# Altium schematic sheet tekprobe.SchDoc: TEKPROBE power supply
size 138 x 199 mm; Date: 2 MAY 2021; DocumentNumber: 7.13.27.001.0521; Revision: R1 / 2 MAY 2021; SheetNumber: 1; SheetTotal: 2; _Page_Title: DC DC Converter; ProjectName: Stromnetz
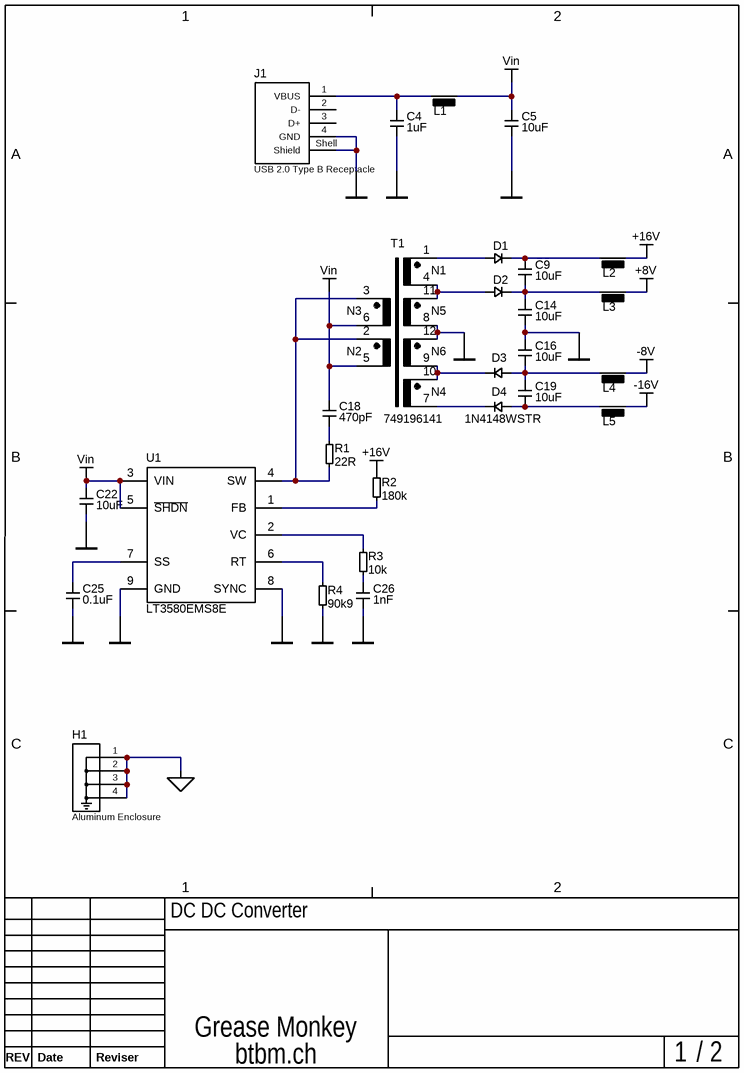
[diagram p0: tekprobe.SchDoc]

## Parts
C4  1uF  [CAP_0805]
C5  10uF  [CAP_0805]
C9  10uF  [CAP_0805]
C14  10uF  [CAP_0805]
C16  10uF  [CAP_0805]
C18  470pF  [CAP_0805]
C19  10uF  [CAP_0805]
C22  10uF  [CAP_0805]
C25  0.1uF  [CAP_0805]
C26  1nF  [CAP_0805]
D1  1N4148WSTR  [SODFL250X100-2N]  (value not drawn)
D2  1N4148WSTR  [SODFL250X100-2N]  (value not drawn)
D3  1N4148WSTR  [SODFL250X100-2N]  (value not drawn)
D4  1N4148WSTR  [SODFL250X100-2N]
H1  Aluminum Enclosure  [1550Q]
J1  USB 2.0 Type B Receptacle  [61400413321]
L1  Ferrite Bead  [RES_0805]  (value not drawn)
L2  Ferrite Bead  [RES_0805]  (value not drawn)
L3  Ferrite Bead  [RES_0805]  (value not drawn)
L4  Ferrite Bead  [RES_0805]  (value not drawn)
L5  Ferrite Bead  [RES_0805]  (value not drawn)
R1  22R  [RES_0805]
R2  180k  [RES_0805]
R3  10k  [RES_0805]
R4  90k9  [RES_0805]
T1  Manufacturer Part Number: 749196141  [WE-FLEX_ER11/5]  (hidden comment: Transformer)
U1  LT3580EMS8E  [LT3580]

## Nets
0V: C4.2 C5.2 C14.2 C16.1 C22.2 C25.2 C26.2 H1.1(DATA) H1.2(-15V) H1.3(-5V) H1.4(OFFSET) J1.4(GND) J1.Shell(Shield) R4.2 T1.8(N5) T1.12(N6dot) U1.8(SYNC) U1.9(GND)
+8V: L3.2
+16V: L2.2 R2.1
-8V: L4.2
-16V: L5.2
Vin: C5.1 C18.1 C22.1 L1.2 T1.5(N2) T1.6(N3) U1.3(VIN) U1.5(~{SHDN})
NetC4_1: C4.1 J1.1(VBUS) L1.1
NetC9_1: C9.1 D1.K L2.1
NetC9_2: C9.2 C14.1 D2.K L3.1
NetC16_2: C16.2 C19.1 D3.A L4.1
NetC18_2: C18.2 R1.1
NetC19_2: C19.2 D4.A L5.1
NetC25_1: C25.1 U1.7(SS)
NetC26_1: C26.1 R3.2
NetD1_A: D1.A T1.1(N1dot)
NetD2_A: D2.A T1.4(N1) T1.11(N5dot)
NetD3_K: D3.K T1.9(N6) T1.10(N4dot)
NetD4_K: D4.K T1.7(N4)
NetR1_2: R1.2 T1.2(N2dot) T1.3(N3dot) U1.4(SW)
NetR2_2: R2.2 U1.1(FB)
NetR3_1: R3.1 U1.2(VC)
NetR4_1: R4.1 U1.6(RT)

Not connected (* = marked no-connect by the designer): J1 2(D-) 3(D+)

## Notes on the sheet
- 1
- 2
- A
- B
- C
- REV
- Date
- Reviser
- Grease Monkey
- btbm.ch
- /

## Library data of the parts
C4 = CL21B105KAFNFNE: CAP CER 1UF 25V X7R 0805; Manufacturer: Samsung; Tolerance: 10%; Supplier 1: Digi-Key; Manufacturer Part Number: CL21B105KAFNFNE; RoHS: Yes; Category: Ceramic Capacitors; Stock 1: 271579; Pricing 1: 1=0.10000, 10=0.07300, 50=0.03980, 100=0.03260, 500=0.02326, 1000=0.01828 (USD); Mount: Surface Mount; Case/Package: 0805; Case Code (Metric): 2012; Case Code (Imperial): 0805; Min Operating Temperature: -55°C; Max Operating Temperature: 125°C; Capacitance: 1uF; Voltage Rating: 25V; Package Quantity: 1; Packaging: Tape and Reel; Dielectric: X7R; Series: CL; Construction: Flat; Length: 0.079inch; Width: 0.049inch; Height: 1.25mm; Thickness: 0.053inch; Depth: 1.25mm; Radiation Hardening: No; RoHS Compliant: Yes; ComponentLink1URL: https://datasheet.ciiva.com/25713/cl21b105kafnfne-25713092.pdf?src-supplier=Digi-Key; ComponentLink1Description: https://datasheet.ciiva.com/25713/cl21b105kafnfne-25713092.pdf?src-supplier=Digi-Key; Supplier Part Number 1: 1276-2926-1-ND
C5 C9 C14 C16 C19 C22 = CL21A106KAYNNNG: CAP CER 10UF 25V X5R 0805; Manufacturer: Samsung; Tolerance: 10%; Supplier 1: Digi-Key; Manufacturer Part Number: CL21A106KAYNNNG; RoHS: Yes; Category: Ceramic Capacitors; Stock 1: 221798; Pricing 1: 1=0.21000, 10=0.14600, 50=0.08280, 100=0.06870, 500=0.04816, 1000=0.03987 (USD); Mount: Surface Mount; Case/Package: 0805; Case Code (Metric): 2012; Case Code (Imperial): 0805; Min Operating Temperature: -55°C; Max Operating Temperature: 85°C; Capacitance: 10uF; Dielectric: X5R; Packaging: Tape and Reel; Package Quantity: 3000; Voltage Rating: 25V; Series: CL; Construction: Flat; Length: 2mm; Width: 0.049inch; Height: 1.25mm; Thickness: 0.057inch; Depth: 1.25mm; Radiation Hardening: No; Lead Free: Lead Free; RoHS Compliant: Yes; ComponentLink1URL: https://datasheet.ciiva.com/26920/getdatasheetpartid-660292-26920195.pdf?src-supplier=Verical; ComponentLink1Description: https://datasheet.ciiva.com/26920/getdatasheetpartid-660292-26920195.pdf?src-supplier=Verical; Supplier Part Number 1: 1276-6454-1-ND
C18 = 885012207084: CAP CER 470PF 50V X7R 0805; Manufacturer: Wurth Electronics; Tolerance: 10%; Supplier 1: Digi-Key; Manufacturer Part Number: 885012207084; RoHS: Yes; Category: Ceramic Capacitors; Stock 1: 227; Pricing 1: 1=0.10000, 10=0.04000, 100=0.03590, 500=0.03172 (USD); Mount: Surface Mount; Case/Package: 0805; Case Code (Metric): 2012; Case Code (Imperial): 0805; Min Operating Temperature: -55°C; Max Operating Temperature: 125°C; Packaging: Tape and Reel; Capacitance: 470pF; Voltage Rating: 50V; Length: 0.079inch; Width: 0.049inch; Thickness: 0.035inch; RoHS Compliant: Yes; ComponentLink1URL: https://katalog.we-online.de/pbs/datasheet/885012207084.pdf?src-supplier=Digi-Key; ComponentLink1Description: https://katalog.we-online.de/pbs/datasheet/885012207084.pdf?src-supplier=Digi-Key; Supplier Part Number 1: 732-8066-1-ND
C25 = CL21B104MACNNNC: CAP CER 0.1UF 25V X7R 0805; Manufacturer: Samsung; Tolerance: 20%; Capacitance: 100nF; Supplier 1: Digi-Key; Manufacturer Part Number: CL21B104MACNNNC; RoHS: Yes; Category: Ceramic Capacitors; Stock 1: 134913; Pricing 1: 1=0.10000, 10=0.03200, 50=0.01720, 100=0.01410, 500=0.01006, 1000=0.00791 (USD); Mount: Surface Mount; Case/Package: 0805; Case Code (Metric): 2012; Case Code (Imperial): 0805; Min Operating Temperature: -55°C; Max Operating Temperature: 125°C; Dielectric: X7R; Packaging: Tape and Reel; Package Quantity: 1; Voltage Rating: 25V; Voltage Rating (DC): 25V; Series: CL; Construction: Flat; Length: 2mm; Width: 0.049inch; Height: 0.85mm; Depth: 1.25mm; Thickness: 0.037inch; Radiation Hardening: No; Lead Free: Lead Free; RoHS Compliant: Yes; ComponentLink1URL: https://datasheet.ciiva.com/26936/getdatasheetpartid-782453-26936905.pdf?src-supplier=Verical; ComponentLink1Description: https://datasheet.ciiva.com/26936/getdatasheetpartid-782453-26936905.pdf?src-supplier=Verical; Supplier Part Number 1: 1276-2449-1-ND
C26 = CL21B102KBANNNC: Cap Ceramic 0.001uF 50VDC X7R 10% SMD 0805 Paper T/R; Manufacturer: Samsung; Voltage Rating: 50V; Supplier 1: Digi-Key; Manufacturer Part Number: CL21B102KBANNNC; RoHS: Yes; Category: Ceramic Capacitors; Stock 1: 281332; Pricing 1: 1=0.10000, 10=0.04300, 50=0.02340, 100=0.01920, 500=0.01368, 1000=0.01075 (USD); Mount: Surface Mount; Case/Package: 0805; Case Code (Metric): 2012; Case Code (Imperial): 0805; Material: Ceramic; Contact Plating: Tin; Min Operating Temperature: -55°C; Max Operating Temperature: 125°C; Tolerance: 10%; Capacitance: 1nF; Dielectric: X7R; Packaging: Tape and Reel; Package Quantity: 4000; Voltage: 50V; Series: CL; Construction: Flat; Length: 2mm; Width: 0.049inch; Height: 0.65mm; Depth: 1.25mm; Thickness: 0.03inch; Radiation Hardening: No; RoHS Compliant: Yes; ComponentLink1URL: https://datasheet.ciiva.com/25802/cl21b102kbannnc-25802496.pdf?src-supplier=Digi-Key; ComponentLink1Description: https://datasheet.ciiva.com/25802/cl21b102kbannnc-25802496.pdf?src-supplier=Digi-Key; ComponentLink2URL: https://datasheet.ciiva.com/26838/getdatasheetpartid-357425-26838638.pdf?src-supplier=Verical; ComponentLink2Description: https://datasheet.ciiva.com/26838/getdatasheetpartid-357425-26838638.pdf?src-supplier=Verical; ComponentLink3URL: https://datasheet.ciiva.com/29199/456076-da-01-en-vs-kondensator-0805-29199069.pdf?src-supplier=Conrad; ComponentLink3Description: https://datasheet.ciiva.com/29199/456076-da-01-en-vs-kondensator-0805-29199069.pdf?src-supplier=Conrad; Supplier Part Number 1: 1276-1020-1-ND
D1-D4 = 1N4148WSTR: DIODE GEN PURP 75V 300MA SOD323; Manufacturer: SMC; Reverse Recovery Time: 4ns; Supplier 1: Digi-Key; Manufacturer Part Number: 1N4148WSTR; RoHS: No; Category: Rectifier Diodes; Stock 1: 173635; Pricing 1: 1=0.13000, 10=0.12100, 100=0.06610, 500=0.04066, 1000=0.02772 (USD); Mount: Surface Mount; Packaging: Tape and Reel; Max Reverse Voltage (DC): 75V; Average Rectified Current: 300mA; ComponentLink1URL: http://www.smc-diodes.com/propdf/1N4148WS%20N0572%20REV.B.pdf?src-supplier=Digi-Key; ComponentLink1Description: http://www.smc-diodes.com/propdf/1N4148WS%20N0572%20REV.B.pdf?src-supplier=Digi-Key; Supplier Part Number 1: 1655-1359-1-ND
H1 = 1550Q: BOX ALUM UNPAINTED 2.36"LX2.17"W; Manufacturer: Hammond Manufacturing; Body Material: Aluminium; Ratings: IP54; Supplier 1: Digi-Key; Manufacturer Part Number: 1550Q; RoHS: Yes; Category: Enclosures; Stock 1: 666; Pricing 1: 1=6.46000, 5=5.97600, 10=5.49100, 25=5.16800, 50=4.84500, 100=4.52200, 250=4.44124, 500=4.36050, 1000=4.29590 (USD); Case/Package: Metal; Material: Aluminium,Metal; Weight: 6.702053oz; Housing Material: Aluminium; Color: Natural; Package Quantity: 1; Length: 2.362inch; Width: 2.17inch; Height: 1.185inch; Thickness: 0.059inch; Depth: 26mm; REACH SVHC: No SVHC; ComponentLink1URL: https://datasheet.ciiva.com/20198/30-3787-20198174.pdf?src-supplier=Rapid+Electronics; ComponentLink1Description: https://datasheet.ciiva.com/20198/30-3787-20198174.pdf?src-supplier=Rapid+Electronics; ComponentLink2URL: https://datasheet.ciiva.com/29344/534473-da-01-en-aluminiumgeh-1550q-60x55x30mm-29344749.pdf?src-supplier=Conrad; ComponentLink2Description: https://datasheet.ciiva.com/29344/534473-da-01-en-aluminiumgeh-1550q-60x55x30mm-29344749.pdf?src-supplier=Conrad; ComponentLink3URL: https://datasheet.ciiva.com/16928/70165840-16928747.pdf?src-supplier=Allied+Electronics; ComponentLink3Description: https://datasheet.ciiva.com/16928/70165840-16928747.pdf?src-supplier=Allied+Electronics; Supplier Part Number 1: HM1204-ND
J1 = 61400413321: USB 2.0 Type B, Receptacle, Vertical, THT; Manufacturer: Wurth Elektronik; Rated Current: 1.5A; Pin Number: 4; Interface Type: Type B; Working Voltage: 30VAC; ComponentLink1Description: Manufacturer; ComponentLink1URL: http://www.we-online.de; ComponentLink2Description: Datasheet; ComponentLink2URL: https://katalog.we-online.com/em/datasheet/61400413321.pdf; Published Date: August 2020; Manufacturer Part Number: 61400413321; Gender: Receptacle; Type: Vertical; Packaging: Tray; Operating Temperature: -40 to +105degC; Mounting Technology: THT; Application: USB 2.0
L1-L5 = MFBW1V2012-801-R: Ferrite Chip Bead 800Ohm 800mA 0.3Ohm Multi-Layer 2-Pin 0805 T/R; Manufacturer: Cooper Bussmann; Supplier 1: Digi-Key; Manufacturer Part Number: MFBW1V2012-801-R; Stock 1: 1000; Pricing 1: 1=0.10000, 10=0.04800, 25=0.04280, 50=0.03820, 100=0.03250, 250=0.02868, 500=0.02628, 1000=0.02245 (USD); ComponentLink1URL: http://datasheet.octopart.com/MFBW1V2012-801-R-Cooper-Bussmann-datasheet-147669139.pdf?src-supplier=Sager+Electronics; ComponentLink1Description: http://datasheet.octopart.com/MFBW1V2012-801-R-Cooper-Bussmann-datasheet-147669139.pdf?src-supplier=Sager+Electronics; Supplier Part Number 1: 283-MFBW1V2012-801-RCT-ND
R1 = RMCF0805FT22R0: RES 22 OHM 1/8W 1% 0805 SMD; Manufacturer: Stackpole Electronics; Power Rating: 125mW; Temperature Coefficient: 100ppm/°C; Supplier 1: Digi-Key; Manufacturer Part Number: RMCF0805FT22R0; RoHS: Yes; Category: Chip SMD Resistors; Stock 1: 126411; Pricing 1: 1=0.10000, 10=0.02700, 100=0.01090, 1000=0.00488, 2500=0.00423 (USD); Mount: Surface Mount; Case/Package: 0805; Case Code (Metric): 2012; Case Code (Imperial): 0805; Contact Plating: Tin,Matte; Size Code: 0805; Min Operating Temperature: -55°C; Max Operating Temperature: 155°C; Resistance: 22R; Tolerance: 1%; Packaging: Tape and Reel; Resistor Type: Thick Film; Number of Terminations: 2; Max Power Dissipation: 125mW; Features: Automotive AEC-Q200; Series: RMCF; Length: 0.079inch; Width: 0.049inch; Height: 0.026inch; Radiation Hardening: No; Lead Free: Lead Free; RoHS Compliant: Yes; ComponentLink1URL: http://components.arrow.com/part/dataview/53343875S4424N1174?src-supplier=Arrow+Electronics; ComponentLink1Description: http://components.arrow.com/part/dataview/53343875S4424N1174?src-supplier=Arrow+Electronics; ComponentLink2URL: https://www.seielect.com/catalog/SEI-Packaging.pdf?src-supplier=Digi-Key; ComponentLink2Description: https://www.seielect.com/catalog/SEI-Packaging.pdf?src-supplier=Digi-Key; ComponentLink3URL: http://www.seielect.com/Catalog/SEI-RMC.pdf?src-supplier=Future+Electronics; ComponentLink3Description: http://www.seielect.com/Catalog/SEI-RMC.pdf?src-supplier=Future+Electronics; ComponentLink4URL: https://www.seielect.com/catalog/SEI-RMCF_RMCP.pdf?src-supplier=Avnet; ComponentLink4Description: https://www.seielect.com/catalog/SEI-RMCF_RMCP.pdf?src-supplier=Avnet; Supplier Part Number 1: RMCF0805FT22R0CT-ND
R2 = RK73H2ATTD1803F: Thick Film Resistors 1/4W 180K OHM 1%; Manufacturer: KOA Speer; Resistance: 180kR; Power Rating: 125mW; Voltage Rating: 150V; Temperature Coefficient: 100ppm/°C; Supplier 1: Digi-Key; Manufacturer Part Number: RK73H2ATTD1803F; RoHS: Yes; Category: Chip SMD Resistors; Stock 1: 4592; Pricing 1: 1=0.10000, 10=0.03500, 100=0.01420, 1000=0.00640, 2500=0.00556 (USD); Case/Package: 0805; Number of Pins: 2; Case Code (Imperial): 0805; Case Code (Metric): 2012; Min Operating Temperature: -55°C; Max Operating Temperature: 155°C; Tolerance: 1%; Packaging: Tape and Reel; Resistor Type: Thick Film; Termination: SMD/SMT; Series: RK73H; Construction: Rectangular; Resistance Tolerance: 1%; Length: 2mm; Depth: 1.25mm; Military Standard: Not; Lead Free: Lead Free; RoHS Compliant: Yes; ComponentLink1URL: https://datasheet.ciiva.com/5557/rk73h-5557292.pdf?src-supplier=Mouser; ComponentLink1Description: https://datasheet.ciiva.com/5557/rk73h-5557292.pdf?src-supplier=Mouser; ComponentLink2URL: https://datasheet.ciiva.com/7763/549017-7763166.pdf?src-supplier=Element14; ComponentLink2Description: https://datasheet.ciiva.com/7763/549017-7763166.pdf?src-supplier=Element14; Supplier Part Number 1: 2019-RK73H2ATTD1803FCT-ND
R3 = RMCF0805FT10K0: RES 10K OHM 1% 1/8W 0805; Manufacturer: Stackpole Electronics; Resistance: 10kR; Power Rating: 125mW; Temperature Coefficient: 100ppm/°C; Supplier 1: Digi-Key; Manufacturer Part Number: RMCF0805FT10K0; RoHS: Yes; Category: Chip SMD Resistors; Stock 1: 1832609; Pricing 1: 1=0.10000, 10=0.02700, 100=0.01090, 1000=0.00488, 2500=0.00423 (USD); Mount: Surface Mount; Case/Package: 0805; Case Code (Metric): 2012; Case Code (Imperial): 0805; Contact Plating: Tin,Matte; Size Code: 0805; Min Operating Temperature: -55°C; Max Operating Temperature: 155°C; Tolerance: 1%; Packaging: Tape and Reel; Resistor Type: Thick Film; Number of Terminations: 2; Max Power Dissipation: 125mW; Features: Automotive AEC-Q200; Series: RMCF; Construction: Rectangular; Length: 2mm; Width: 0.049inch; Height: 0.026inch; Depth: 1.25mm; Radiation Hardening: No; Lead Free: Lead Free; Military Standard: Not; RoHS Compliant: Yes; ComponentLink1URL: https://datasheet.ciiva.com/15193/getdatasheetpartid-362046-15193525.pdf?src-supplier=Verical; ComponentLink1Description: https://datasheet.ciiva.com/15193/getdatasheetpartid-362046-15193525.pdf?src-supplier=Verical; Supplier Part Number 1: RMCF0805FT10K0CT-ND
R4 = RMCF0805FT90K9: Res Thick Film 0805 90.9K Ohm 1% 0.125W ±100ppm/°C Molded SMD Paper T/R; Manufacturer: Stackpole Electronics; Resistance: 90.9kR; Power Rating: 125mW; Supplier 1: Digi-Key; Manufacturer Part Number: RMCF0805FT90K9; RoHS: Yes; Category: Chip SMD Resistors; Stock 1: 27691; Pricing 1: 1=0.10000, 10=0.02700, 100=0.01090, 1000=0.00488, 2500=0.00423 (USD); Mount: Surface Mount; Case/Package: 0805; Case Code (Metric): 2012; Case Code (Imperial): 0805; Contact Plating: Tin,Matte; Size Code: 0805; Min Operating Temperature: -55°C; Max Operating Temperature: 155°C; Tolerance: 1%; Packaging: Tape and Reel; Resistor Type: Thick Film; Number of Terminations: 2; Max Power Dissipation: 125mW; Temperature Coefficient: 100ppm/°C; Features: Automotive AEC-Q200; Series: RMCF; Construction: Rectangular; Length: 0.079inch; Width: 0.049inch; Height: 0.026inch; Depth: 1.25mm; Radiation Hardening: No; Military Standard: Not; Lead Free: Lead Free; RoHS Compliant: Yes; ComponentLink1URL: https://datasheet.ciiva.com/3882/40960751s7172021n1174-3882844.pdf?src-supplier=Arrow+Electronics; ComponentLink1Description: https://datasheet.ciiva.com/3882/40960751s7172021n1174-3882844.pdf?src-supplier=Arrow+Electronics; ComponentLink2URL: https://datasheet.ciiva.com/15193/getdatasheetpartid-464223-15193623.pdf?src-supplier=Verical; ComponentLink2Description: https://datasheet.ciiva.com/15193/getdatasheetpartid-464223-15193623.pdf?src-supplier=Verical; Supplier Part Number 1: RMCF0805FT90K9CT-ND
T1 = Transformer_749196141: Flex Transformer WE-FLEX ER11/5; Manufacturer: Wurth Electronics; Secondary Current: 550mA; Inductance: 8.5uH; Turns Ratio: 1:1; Isolation Voltage: 500V; DC Resistance (DCR): 344mR; Max Frequency: 1MHz; Supplier 1: Digi-Key; RoHS: Yes; Category: Uncategorized; Stock 1: 1871; Pricing 1: 1=5.06000, 10=4.59200, 50=4.15500, 100=3.69600 (USD); Mount: Surface Mount; Min Operating Temperature: -40°C; Max Operating Temperature: 125°C; Packaging: Cut Tape; Series: WE-FLEX; Length: 12.9mm; Width: 9.2mm; Depth: 6.2mm; RoHS Compliant: Yes; ComponentLink1URL: https://datasheet.ciiva.com/16989/0900766b80649932-16989928.pdf?src-supplier=Allied+Electronics; ComponentLink1Description: https://datasheet.ciiva.com/16989/0900766b80649932-16989928.pdf?src-supplier=Allied+Electronics
U1 = LT3580EMS8E: IC REG MULT CONFIG INV ADJ 8MSOP; Manufacturer: Analog Devices / Linear Technology; Manufacturer Part Number: LT3580EMS8E#PBF; Max Input Voltage: 32V; Max Output Current: 2.8A; Min Input Voltage: 2.5V; Output Current: 2A; Output Voltage: 12V; Efficiency: 88%; Number of Outputs: 1; Switching Frequency: 2.5MHz; Synchronous Rectifier: No; Max Output Voltage: 42V; Min Output Voltage: -400mV; Topology: Boost; Output Type: Fixed,Adjustable; Supplier 1: Digi-Key; RoHS: Yes; Category: Voltage Regulators - Switching; Stock 1: 2999; Pricing 1: 1=5.62000, 10=5.04600, 25=4.77000, 100=4.13400, 250=3.92200, 500=3.51920, 1000=3.00000 (USD); Case/Package: MSOP; Number of Pins: 8; Min Operating Temperature: -40°C; Max Operating Temperature: 125°C; Package Quantity: 50; Packaging: Rail/Tube; Length: 3mm; Width: 3mm; Height: 0.86mm; REACH SVHC: No SVHC; ComponentLink1URL: https://datasheet.ciiva.com/7363/85270-7363576.pdf?src-supplier=Newark; ComponentLink1Description: https://datasheet.ciiva.com/7363/85270-7363576.pdf?src-supplier=Newark; ComponentLink2URL: https://datasheet.ciiva.com/6192/1599224-6192934.pdf?src-supplier=Farnell; ComponentLink2Description: https://datasheet.ciiva.com/6192/1599224-6192934.pdf?src-supplier=Farnell; ComponentLink3URL: https://datasheet.ciiva.com/7905/1599224-7905879.pdf?src-supplier=Element14; ComponentLink3Description: https://datasheet.ciiva.com/7905/1599224-7905879.pdf?src-supplier=Element14; ComponentLink4URL: https://datasheet.ciiva.com/2024/29562-2024728.pdf?src-supplier=Digi-Key; ComponentLink4Description: https://datasheet.ciiva.com/2024/29562-2024728.pdf?src-supplier=Digi-Key; Supplier Part Number 1: LT3580EMS8E#PBF-ND